# EAGLE design oshi-fuse-board-mk-3_5x20mm (EAGLE 6.5.0)
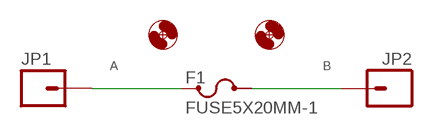
[diagram p0: schematic, sheet 1]

## Parts
F1  FUSE5X20MM-1  [FUSE_5MM]
H1  HOLE#2  [HOLE-#2]
H2  HOLE#2  [HOLE-#2]
JP1  M01SCREWITGOOD  [1X01-RING-TERM-6-32-FAT]
JP2  M01SCREWITGOOD  [1X01-RING-TERM-6-32-FAT]

## Nets
A: F1.1 F1.2 JP1.P$1 JP1.P$2 JP1.P$3 JP1.P$4
B: F1.3 F1.4 JP2.P$1 JP2.P$2 JP2.P$3 JP2.P$4

## Library data of the parts
F1 = A_butts:FUSE
H1 H2 = A_butts:HOLE: MOUNTING HOLE with drill center marker
JP1 JP2 = A_butts:M01: Header 1 Standard 1-pin 0.1" header. Use with straight break away headers (SKU : PRT-00116), right angle break away headers (PRT-00553), swiss pins (PRT-00743), machine pins (PRT-00117), and female headers (PRT-00115).

## Board
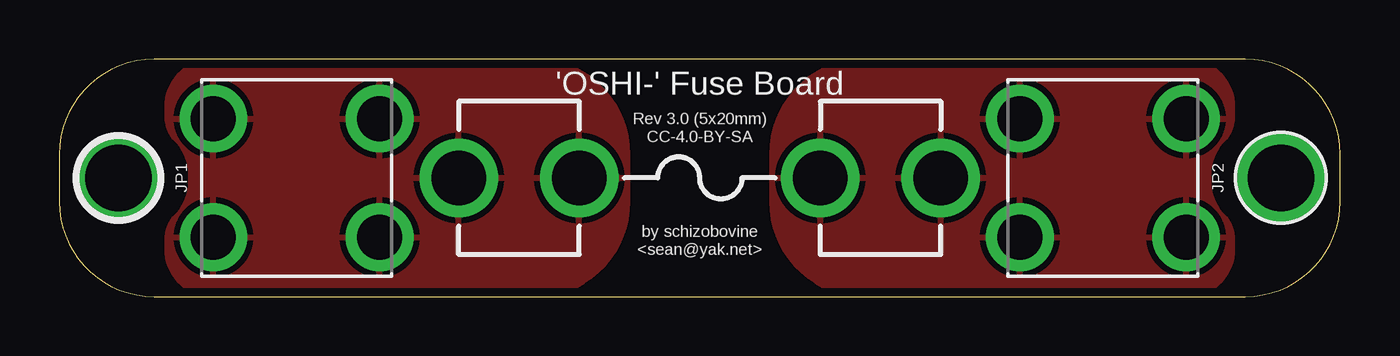
[diagram p1: board, top side]
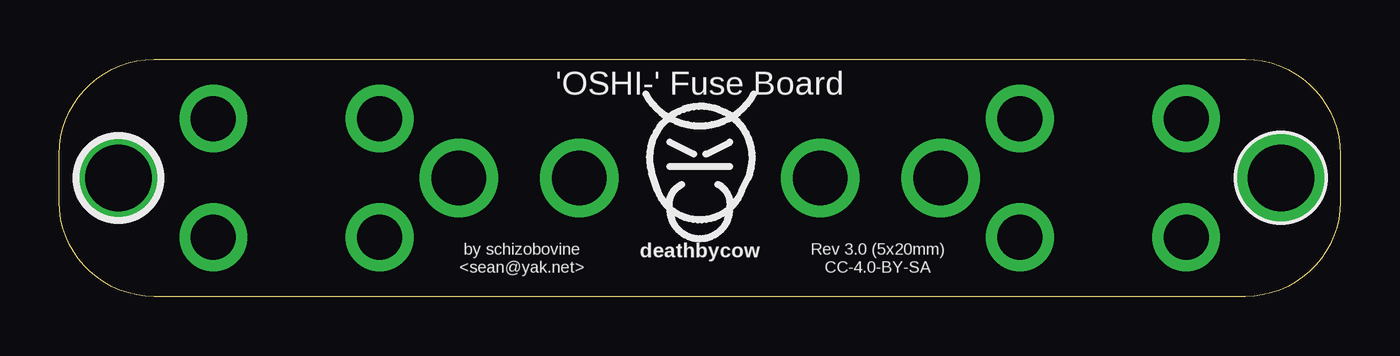
[diagram p2: board, bottom side, seen from below]

Size 54 x 10 mm. Coordinates in mm from the lower left corner, seen from the top.
Outline: 0,6 0,4 arc90 4,0 50,0 arc90 54,4 54,6 arc90 50,10 4,10 arc90 0,6
Copper layers (1*16): Top 0.0356mm / dielectric 1.5011mm / Bottom 0.0356mm
Design rules "LaenPCBOrder_2": minimum track width 6mil, minimum drill 13mil, track to track 6mil, track to pad 6mil, pad to pad 6mil, via to via 6mil, smd to smd 6mil, copper to edge 15mil, drill to drill 6mil, minimum pad ring 7mil, minimum via ring 7mil, stop-mask expansion 3mil, vias tented up to drill 20mil, thermal gap 10mil

### Footprints (pad centres in the part's own frame; a part is rotated, then mirrored left to right if it is on the bottom)
FUSE_5MM = drill 2.286 pad 3.175: 1 0,-10.16; 2 0,-5.08; 3 0,5.08; 4 0,10.16
HOLE-#2 = drill 2.8 pad 3.81: P$1 0,0
1X01-RING-TERM-6-32-FAT = drill 1.9: P$1 -2.5,3.505; P$2 2.5,3.505; P$3 2.5,-3.505; P$4 -2.5,-3.505

### Placement (x,y rotation side)
F1  27,5 270 top
H1  2.5,5 0 top
H2  51.5,5 0 bottom
JP1  10,5 270 top
JP2  44,5 270 top
U$1  [COW_SMALL]  27,6 0 bottom

### Tracks (layer width: path | path; a pad name or v marks a point on that pad's centre or on a via)
A
  pour Top (isolate 0.305): 4.5,7.59 4.5,8 arc-90 6.5,10 20,10 arc-90 24,6 24,4 arc-90 20,0 6.5,0 arc-90 4.5,2 4.5,2.41 arc-45 4.91,3.41 arc45 5.5,4.83 5.5,5.17 arc45 4.91,6.59 arc-45
B
  pour Top (isolate 0.305): 49.5,7.59 49.5,8 arc90 47.5,10 34,10 arc90 30,6 30,4 arc90 34,0 47.5,0 arc90 49.5,2 49.5,2.41 arc45 49.09,3.41 arc-45 48.5,4.83 48.5,5.17 arc-45 49.09,6.59 arc45

### Text on the board
tPlace: 'OSHI-' Fuse Board | Rev 3.0 (5x20mm) / CC-4.0-BY-SA | by schizobovine / <sean@yak.net>
bPlace: 'OSHI-' Fuse Board | Rev 3.0 (5x20mm) / CC-4.0-BY-SA | by schizobovine / <sean@yak.net>